# EAGLE design PT_2015_PB_MAIN_Rev1 (EAGLE 6.5.0)
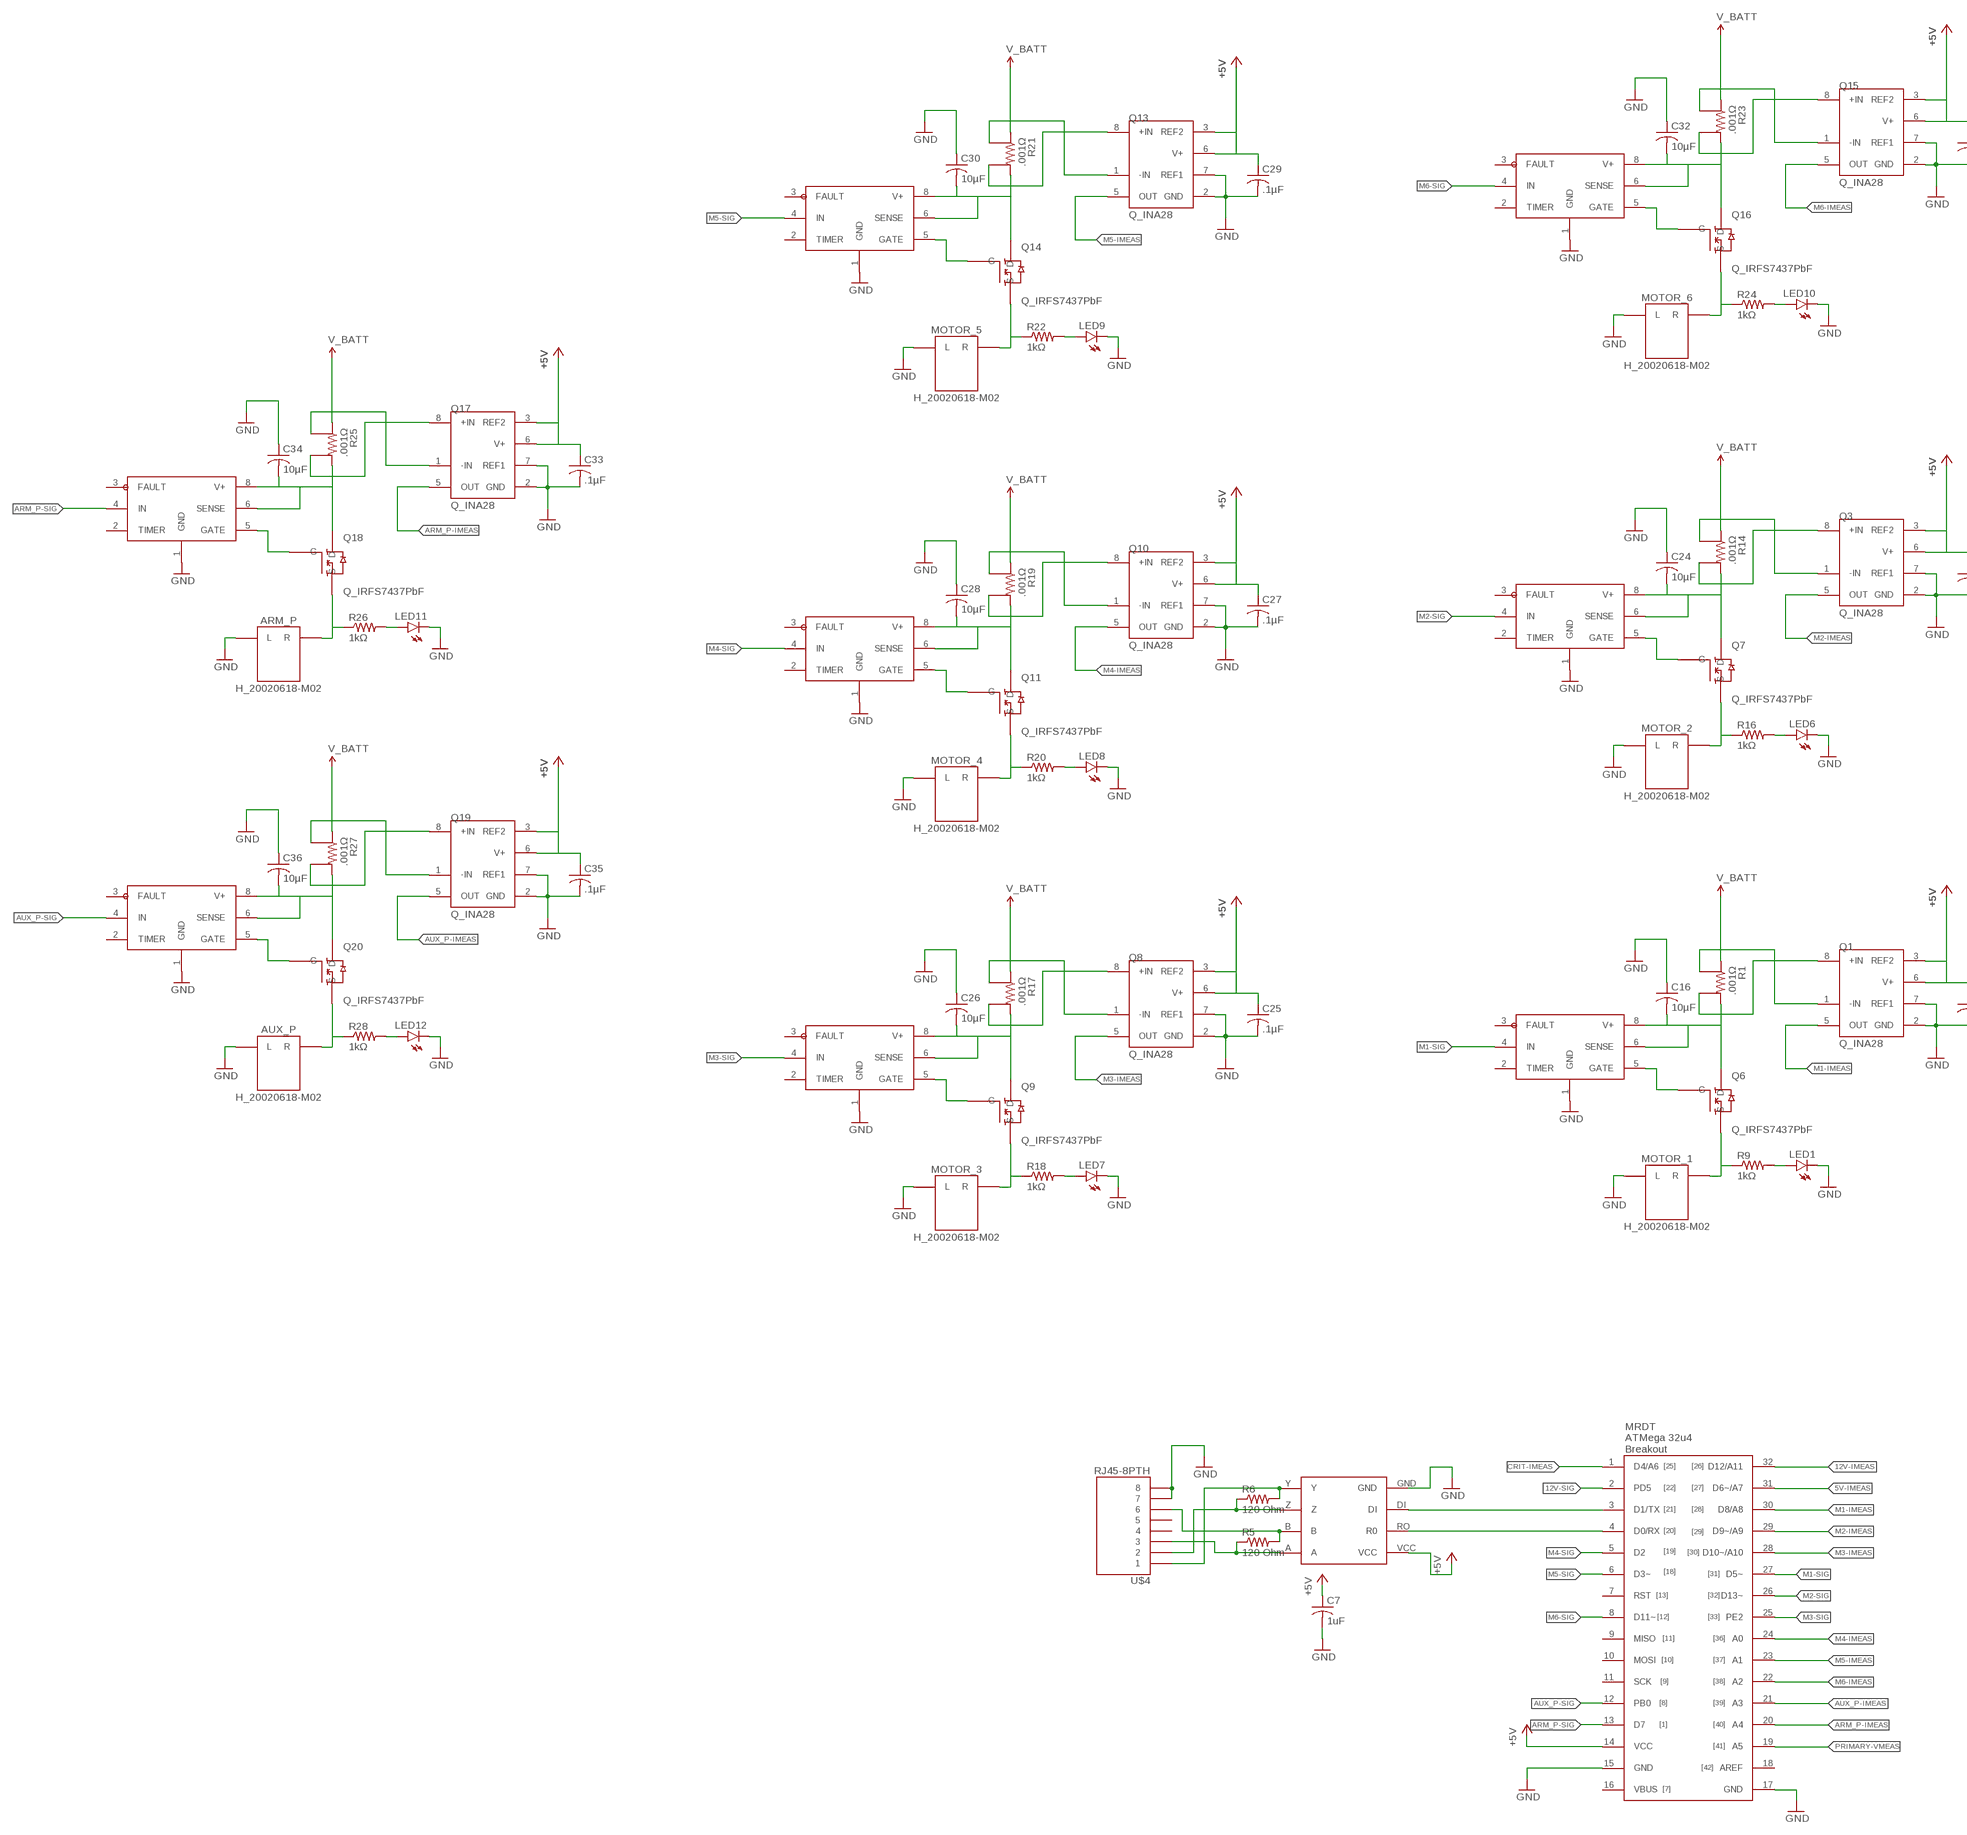
[diagram p0: schematic, sheet 1, part 1 of 2]
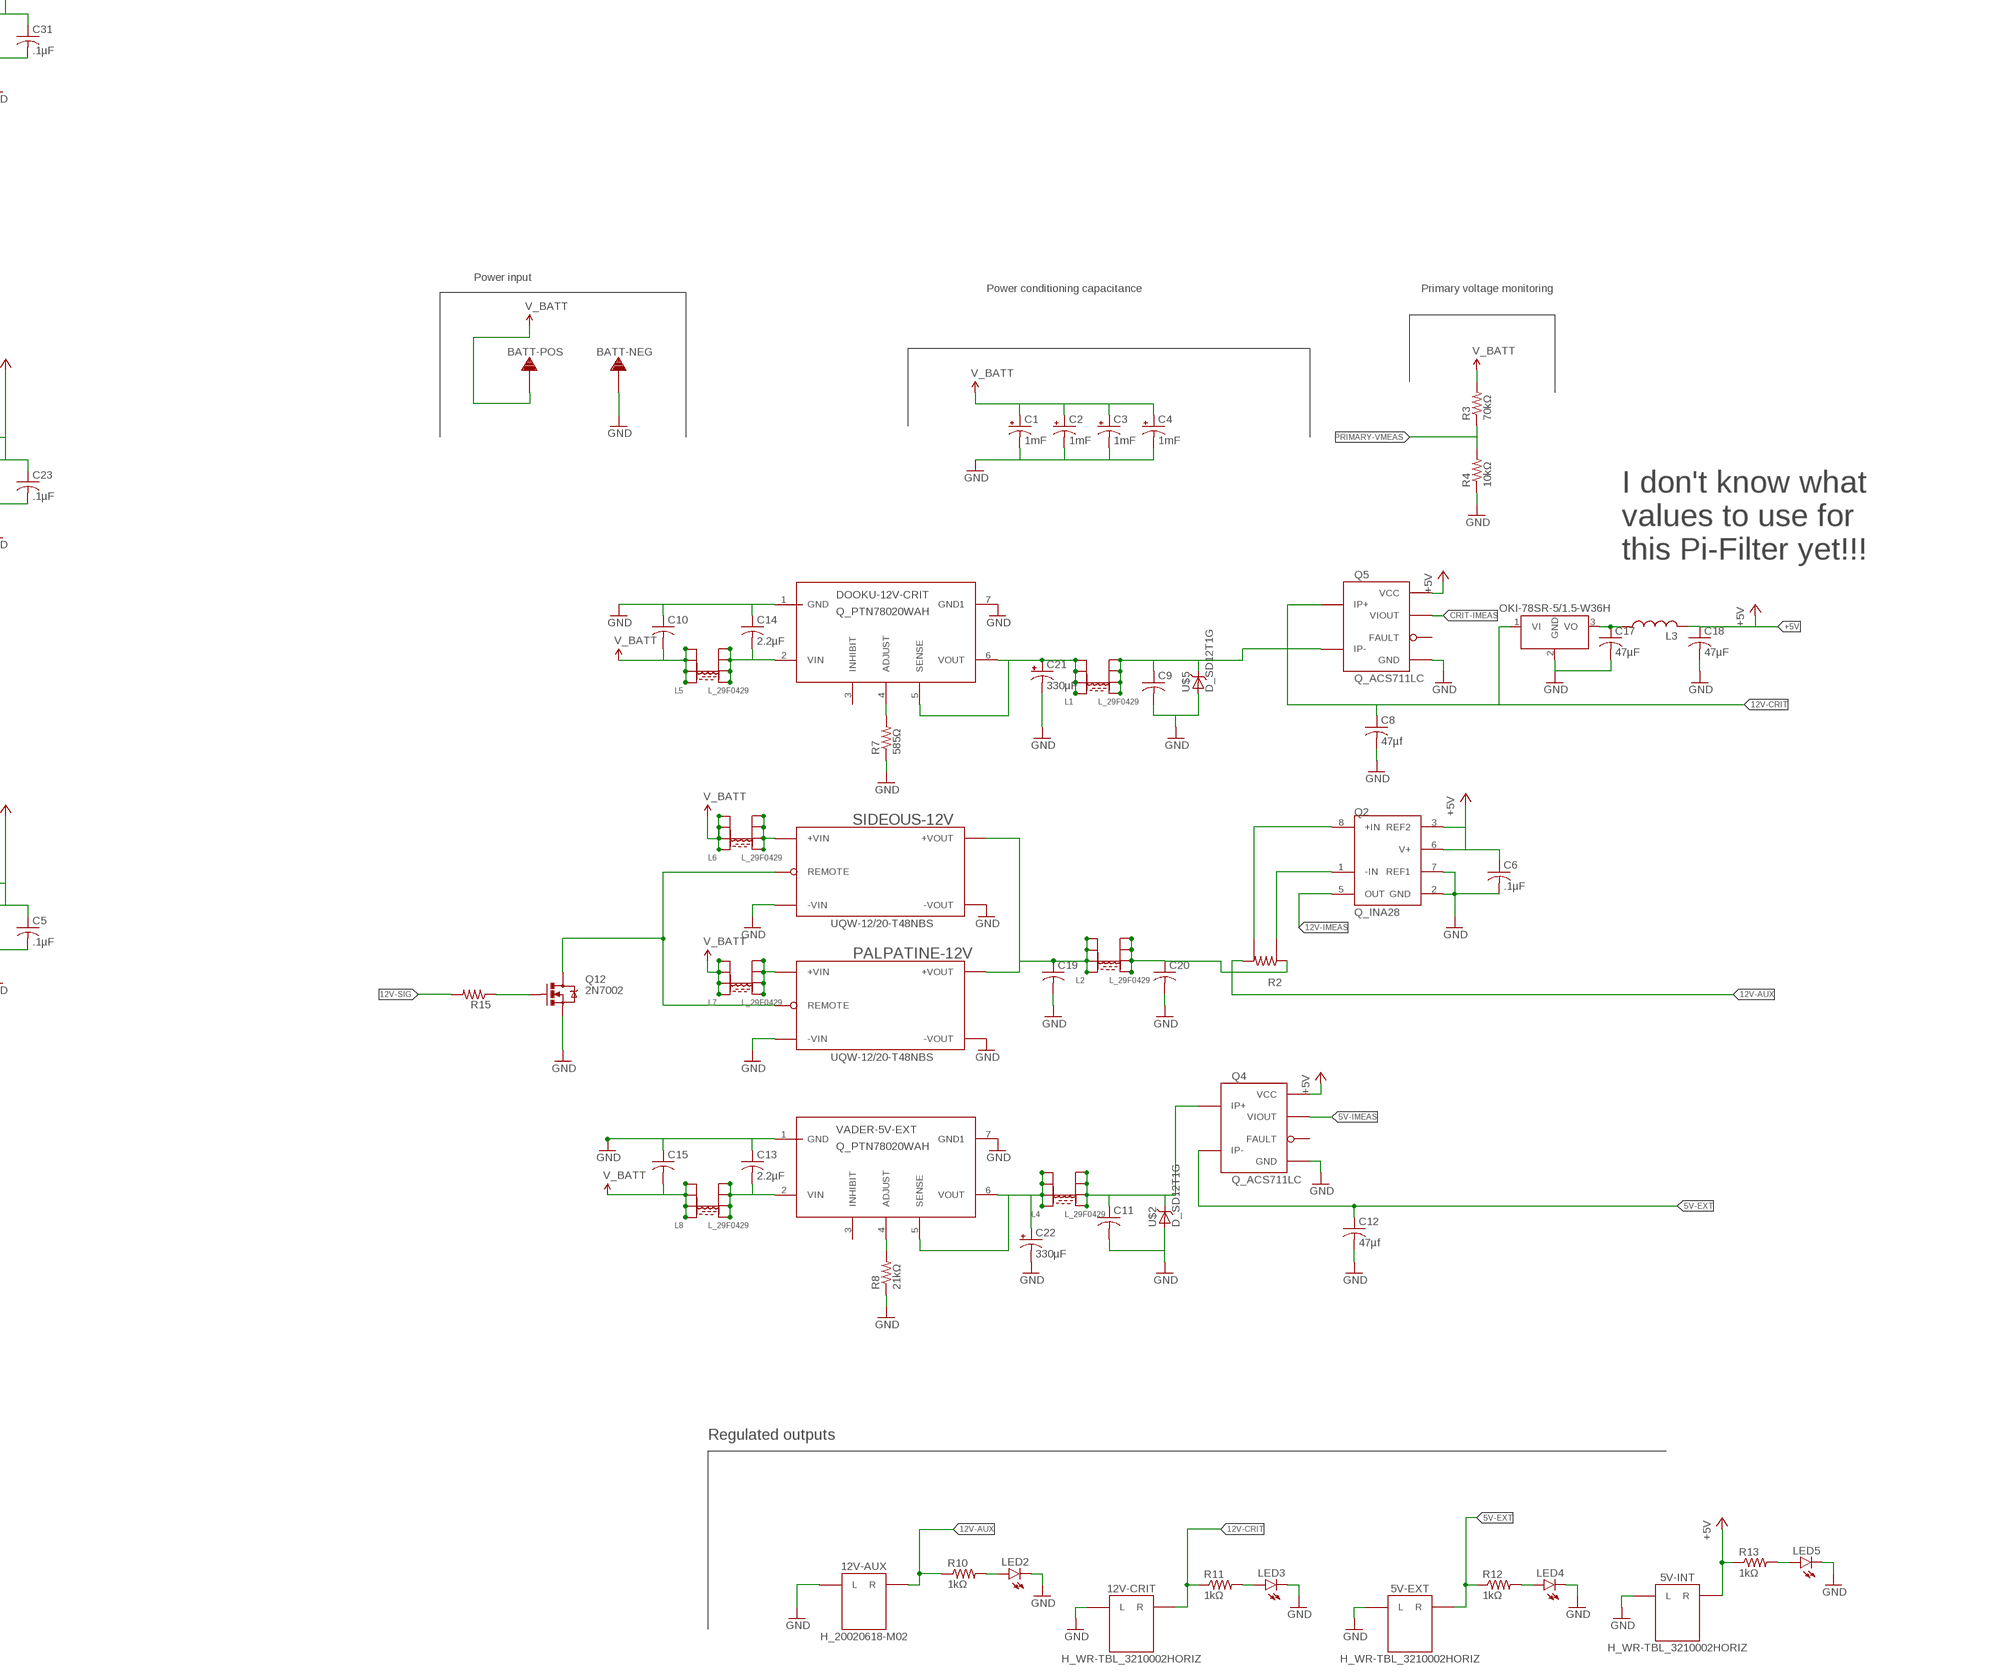
[diagram p1: schematic, sheet 1, part 2 of 2]

## Parts
5V-EXT  H_WR-TBL_3210002HORIZ  [691322110002]
5V-INT  H_WR-TBL_3210002HORIZ  [691322110002]
12V-AUX  H_20020618-M02  [20020618-M02]
12V-CRIT  H_WR-TBL_3210002HORIZ  [691322110002]
ARM_P  H_20020618-M02  [20020618-M02]
AUX_P  H_20020618-M02  [20020618-M02]
BATT-NEG  TERMINAL_HOLE  [LARGE_TERMINAL_HOLE]
BATT-POS  TERMINAL_HOLE  [LARGE_TERMINAL_HOLE]
C1  1mF  C_POL12.5MM_NORMAL  [C_12.5MM]
C2  1mF  C_POL12.5MM_NORMAL  [C_12.5MM]
C3  1mF  C_POL12.5MM_NORMAL  [C_12.5MM]
C4  1mF  C_POL12.5MM_NORMAL  [C_12.5MM]
C5  .1µF  C-USC1206  [C1206]
C6  .1µF  C-USC1206  [C1206]
C7  1uF  C-USC1206  [C1206]
C8  47µf  C-USC1206  [C1206]
C9  C-USC1206  [C1206]
C10  C-USC1206  [C1206]
C11  C-USC1206  [C1206]
C12  47µf  C-USC1206  [C1206]
C13  2.2µF  C-USC1206  [C1206]
C14  2.2µF  C-USC1206  [C1206]
C15  C-USC1206  [C1206]
C16  10µF  C-USC1206  [C1206]
C17  47µF  C-USC1206  [C1206]
C18  47µF  C-USC1206  [C1206]
C19  C-USC1206  [C1206]
C20  C-USC1206  [C1206]
C21  330µF  CPOL-USE5-8.5  [E5-8,5]
C22  330µF  CPOL-USE5-8.5  [E5-8,5]
C23  .1µF  C-USC1206  [C1206]
C24  10µF  C-USC1206  [C1206]
C25  .1µF  C-USC1206  [C1206]
C26  10µF  C-USC1206  [C1206]
C27  .1µF  C-USC1206  [C1206]
C28  10µF  C-USC1206  [C1206]
C29  .1µF  C-USC1206  [C1206]
C30  10µF  C-USC1206  [C1206]
C31  .1µF  C-USC1206  [C1206]
C32  10µF  C-USC1206  [C1206]
C33  .1µF  C-USC1206  [C1206]
C34  10µF  C-USC1206  [C1206]
C35  .1µF  C-USC1206  [C1206]
C36  10µF  C-USC1206  [C1206]
DOOKU-12V-CRIT  Q_PTN78020WAH  Q_PTN78020  [R_PDSS-T7]
L1  L_29F0429  [L_29F0429]
L2  L_29F0429  [L_29F0429]
L3  L-USL3216C  [L3216C]
L4  L_29F0429  [L_29F0429]
L5  L_29F0429  [L_29F0429]
L6  L_29F0429  [L_29F0429]
L7  L_29F0429  [L_29F0429]
L8  L_29F0429  [L_29F0429]
LED1  LED1206  [LED-1206]
LED2  LED1206  [LED-1206]
LED3  LED1206  [LED-1206]
LED4  LED1206  [LED-1206]
LED5  LED1206  [LED-1206]
LED6  LED1206  [LED-1206]
LED7  LED1206  [LED-1206]
LED8  LED1206  [LED-1206]
LED9  LED1206  [LED-1206]
LED10  LED1206  [LED-1206]
LED11  LED1206  [LED-1206]
LED12  LED1206  [LED-1206]
MOTOR_1  H_20020618-M02  [20020618-M02]
MOTOR_2  H_20020618-M02  [20020618-M02]
MOTOR_3  H_20020618-M02  [20020618-M02]
MOTOR_4  H_20020618-M02  [20020618-M02]
MOTOR_5  H_20020618-M02  [20020618-M02]
MOTOR_6  H_20020618-M02  [20020618-M02]
OKI-78SR-5/1.5-W36H  Q_OKI-78SR  [OKI-78SRH]
PALPATINE-12V  UQW-12/20-T48NBS  [U-T48-QB-NO_TRIM]
Q1  Q_INA28  [SOIC8]
Q2  Q_INA28  [SOIC8]
Q3  Q_INA28  [SOIC8]
Q4  Q_ACS711LC  [SOIC8_ACS711]
Q5  Q_ACS711LC  [SOIC8_ACS711]
Q6  Q_IRFS7437PbF  Q_IRF7437SMD  [D2PACK]
Q7  Q_IRFS7437PbF  Q_IRF7437SMD  [D2PACK]
Q8  Q_INA28  [SOIC8]
Q9  Q_IRFS7437PbF  Q_IRF7437SMD  [D2PACK]
Q10  Q_INA28  [SOIC8]
Q11  Q_IRFS7437PbF  Q_IRF7437SMD  [D2PACK]
Q12  2N7002  MOSFET-NCHANNEL2N7002PW  [SOT323]
Q13  Q_INA28  [SOIC8]
Q14  Q_IRFS7437PbF  Q_IRF7437SMD  [D2PACK]
Q15  Q_INA28  [SOIC8]
Q16  Q_IRFS7437PbF  Q_IRF7437SMD  [D2PACK]
Q17  Q_INA28  [SOIC8]
Q18  Q_IRFS7437PbF  Q_IRF7437SMD  [D2PACK]
Q19  Q_INA28  [SOIC8]
Q20  Q_IRFS7437PbF  Q_IRF7437SMD  [D2PACK]
R1  .001Ω  R_FC4L110R001JER  [R_FC4L]
R2  R_FC4L110R001JER  [R_FC4L]
R3  70kΩ  R-US_R1206  [R1206]
R4  10kΩ  R-US_R1206  [R1206]
R5  120 Ohm  RESISTOR1206  [1206]
R6  120 Ohm  RESISTOR1206  [1206]
R7  585Ω  R-US_R1206  [R1206]
R8  21kΩ  R-US_R1206  [R1206]
R9  1kΩ  RESISTOR1206  [1206]
R10  1kΩ  RESISTOR1206  [1206]
R11  1kΩ  RESISTOR1206  [1206]
R12  1kΩ  RESISTOR1206  [1206]
R13  1kΩ  RESISTOR1206  [1206]
R14  .001Ω  R_FC4L110R001JER  [R_FC4L]
R15  R-US_R1206  [R1206]
R16  1kΩ  RESISTOR1206  [1206]
R17  .001Ω  R_FC4L110R001JER  [R_FC4L]
R18  1kΩ  RESISTOR1206  [1206]
R19  .001Ω  R_FC4L110R001JER  [R_FC4L]
R20  1kΩ  RESISTOR1206  [1206]
R21  .001Ω  R_FC4L110R001JER  [R_FC4L]
R22  1kΩ  RESISTOR1206  [1206]
R23  .001Ω  R_FC4L110R001JER  [R_FC4L]
R24  1kΩ  RESISTOR1206  [1206]
R25  .001Ω  R_FC4L110R001JER  [R_FC4L]
R26  1kΩ  RESISTOR1206  [1206]
R27  .001Ω  R_FC4L110R001JER  [R_FC4L]
R28  1kΩ  RESISTOR1206  [1206]
SIDEOUS-12V  UQW-12/20-T48NBS  [U-T48-QB-NO_TRIM]
U$1  32U4_BREAKOUT  [32U4_MCU_DIP]
U$2  D_SD12T1G  [SOD-323]
U$3  MAX3077  [MAX3070E]
U$4  RJ45-8PTH  [RJ45-8]
U$5  D_SD12T1G  [SOD-323]
U$6  LT1910  [SO8]
U$7  LT1910  [SO8]
U$8  LT1910  [SO8]
U$9  LT1910  [SO8]
U$10  LT1910  [SO8]
U$11  LT1910  [SO8]
U$12  LT1910  [SO8]
U$13  LT1910  [SO8]
VADER-5V-EXT  Q_PTN78020WAH  Q_PTN78020  [R_PDSS-T7]

## Nets
5V-EXT: 5V-EXT.R C12.1 Q4.4(IP-) R12.1
5V-IMEAS: Q4.7(VIOUT) U$1.31(D6~/A7)
12V-AUX: 12V-AUX.R1(R) 12V-AUX.R2(R) R2.2 R10.1
12V-CRIT: 12V-CRIT.R C8.1 OKI-78SR-5/1.5-W36H.1(VI) Q5.1(IP+) R11.1
12V-IMEAS: Q2.5(OUT) U$1.32(D12/A11)
12V-SIG: R15.2 U$1.2(PD5)
+5V: 5V-INT.R C5.1 C6.1 C7.1 C18.1 C23.1 C25.1 C27.1 C29.1 C31.1 C33.1 C35.1 L3.2 Q1.3(REF2) Q1.6(V+) Q2.3(REF2) Q2.6(V+) Q3.3(REF2) Q3.6(V+) Q4.8(VCC) Q5.8(VCC) Q8.3(REF2) Q8.6(V+) Q10.3(REF2) Q10.6(V+) Q13.3(REF2) Q13.6(V+) Q15.3(REF2) Q15.6(V+) Q17.3(REF2) Q17.6(V+) Q19.3(REF2) Q19.6(V+) R13.1 U$1.14(VCC) U$3.VCC
ARM_P-IMEAS: Q17.5(OUT) U$1.20(A4)
ARM_P-SIG: U$1.13(D7) U$12.4(IN)
AUX_P-IMEAS: Q19.5(OUT) U$1.21(A3)
AUX_P-SIG: U$1.12(PB0) U$13.4(IN)
CRIT-IMEAS: Q5.7(VIOUT) U$1.1(D4/A6)
GND: 5V-EXT.L 5V-INT.L 12V-AUX.L1(L) 12V-AUX.L2(L) 12V-CRIT.L ARM_P.L1(L) ARM_P.L2(L) AUX_P.L1(L) AUX_P.L2(L) BATT-NEG.P$1 C1.- C2.- C3.- C4.- C5.2 C6.2 C7.2 C8.2 C9.2 C10.1 C11.2 C12.2 C13.1 C14.1 C15.1 C16.1 C17.2 C18.2 C19.2 C20.2 C21.- C22.- C23.2 C24.1 C25.2 C26.1 C27.2 C28.1 C29.2 C30.1 C31.2 C32.1 C33.2 C34.1 C35.2 C36.1 DOOKU-12V-CRIT.1(GND) DOOKU-12V-CRIT.7(GND1) LED1.C LED2.C LED3.C LED4.C LED5.C LED6.C LED7.C LED8.C LED9.C LED10.C LED11.C LED12.C MOTOR_1.L1(L) MOTOR_1.L2(L) MOTOR_2.L1(L) MOTOR_2.L2(L) MOTOR_3.L1(L) MOTOR_3.L2(L) MOTOR_4.L1(L) MOTOR_4.L2(L) MOTOR_5.L1(L) MOTOR_5.L2(L) MOTOR_6.L1(L) MOTOR_6.L2(L) OKI-78SR-5/1.5-W36H.2(GND) PALPATINE-12V.3(-VIN) PALPATINE-12V.4(-VOUT) Q1.2(GND) Q1.7(REF1) Q2.2(GND) Q2.7(REF1) Q3.2(GND) Q3.7(REF1) Q4.5(GND) Q5.5(GND) Q8.2(GND) Q8.7(REF1) Q10.2(GND) Q10.7(REF1) Q12.2(S) Q13.2(GND) Q13.7(REF1) Q15.2(GND) Q15.7(REF1) Q17.2(GND) Q17.7(REF1) Q19.2(GND) Q19.7(REF1) R4.1 R7.1 R8.1 SIDEOUS-12V.3(-VIN) SIDEOUS-12V.4(-VOUT) U$1.15(GND) U$1.17(GND) U$2.2(A) U$3.GND U$4.7 U$4.8 U$5.2(A) U$6.1(GND) U$7.1(GND) U$8.1(GND) U$9.1(GND) U$10.1(GND) U$11.1(GND) U$12.1(GND) U$13.1(GND) VADER-5V-EXT.1(GND) VADER-5V-EXT.7(GND1)
M1-IMEAS: Q1.5(OUT) U$1.30(D8/A8)
M1-SIG: U$1.27(D5~) U$6.4(IN)
M2-IMEAS: Q3.5(OUT) U$1.29(D9~/A9)
M2-SIG: U$1.26(D13~) U$7.4(IN)
M3-IMEAS: Q8.5(OUT) U$1.28(D10~/A10)
M3-SIG: U$1.25(PE2) U$8.4(IN)
M4-IMEAS: Q10.5(OUT) U$1.24(A0)
M4-SIG: U$1.5(D2) U$9.4(IN)
M5-IMEAS: Q13.5(OUT) U$1.23(A1)
M5-SIG: U$1.6(D3~) U$10.4(IN)
M6-IMEAS: Q15.5(OUT) U$1.22(A2)
M6-SIG: U$1.8(D11~) U$11.4(IN)
N$1: Q1.8(+IN) R1.SENSE2
N$2: Q1.1(-IN) R1.SENSE1
N$3: C13.2 L8.5 L8.6 L8.7 L8.8 VADER-5V-EXT.2(VIN)
N$4: PALPATINE-12V.2(REMOTE) Q12.3(D) SIDEOUS-12V.2(REMOTE)
N$5: L7.5 L7.6 L7.7 L7.8 PALPATINE-12V.1(+VIN)
N$6: L6.5 L6.6 L6.7 L6.8 SIDEOUS-12V.1(+VIN)
N$7: C19.1 L2.1 L2.2 L2.3 L2.4 PALPATINE-12V.8(+VOUT) SIDEOUS-12V.8(+VOUT)
N$8: C14.2 DOOKU-12V-CRIT.2(VIN) L5.5 L5.6 L5.7 L5.8
N$9: DOOKU-12V-CRIT.4(ADJUST) R7.2
N$10: C9.1 L1.5 L1.6 L1.7 L1.8 Q5.4(IP-) U$5.1(C)
N$11: C20.1 L2.5 L2.6 L2.7 L2.8 R2.1
N$12: Q2.8(+IN) R2.SENSE2
N$13: Q2.1(-IN) R2.SENSE1
N$14: R6.2 U$3.Y U$4.1
N$15: C22.+ L4.1 L4.2 L4.3 L4.4 VADER-5V-EXT.5(SENSE) VADER-5V-EXT.6(VOUT)
N$16: C11.1 L4.5 L4.6 L4.7 L4.8 Q4.1(IP+) U$2.1(C)
N$18: R6.1 U$3.Z U$4.2
N$19: R5.2 U$3.B U$4.6
N$20: R5.1 U$3.A U$4.3
N$21: U$1.3(D1/TX) U$3.DI
N$26: Q3.8(+IN) R14.SENSE2
N$27: Q3.1(-IN) R14.SENSE1
N$28: C24.2 Q7.TAB(D) R14.2 U$7.6(SENSE) U$7.8(V+)
N$29: MOTOR_2.R1(R) MOTOR_2.R2(R) Q7.2(S) R16.1
N$30: Q7.1(G) U$7.5(GATE)
N$31: LED6.A R16.2
N$32: Q8.8(+IN) R17.SENSE2
N$35: R8.2 VADER-5V-EXT.4(ADJUST)
N$36: C21.+ DOOKU-12V-CRIT.5(SENSE) DOOKU-12V-CRIT.6(VOUT) L1.1 L1.2 L1.3 L1.4
N$39: LED1.A R9.2
N$40: C16.2 Q6.TAB(D) R1.2 U$6.6(SENSE) U$6.8(V+)
N$41: MOTOR_1.R1(R) MOTOR_1.R2(R) Q6.2(S) R9.1
N$42: Q6.1(G) U$6.5(GATE)
N$43: Q8.1(-IN) R17.SENSE1
N$44: C26.2 Q9.TAB(D) R17.2 U$8.6(SENSE) U$8.8(V+)
N$45: MOTOR_3.R1(R) MOTOR_3.R2(R) Q9.2(S) R18.1
N$46: LED2.A R10.2
N$47: Q9.1(G) U$8.5(GATE)
N$48: LED3.A R11.2
N$49: LED7.A R18.2
N$50: LED4.A R12.2
N$51: Q10.8(+IN) R19.SENSE2
N$52: LED5.A R13.2
N$53: Q10.1(-IN) R19.SENSE1
N$54: C28.2 Q11.TAB(D) R19.2 U$9.6(SENSE) U$9.8(V+)
N$55: MOTOR_4.R1(R) MOTOR_4.R2(R) Q11.2(S) R20.1
N$56: Q11.1(G) U$9.5(GATE)
N$57: LED8.A R20.2
N$58: Q13.8(+IN) R21.SENSE2
N$59: Q13.1(-IN) R21.SENSE1
N$60: C30.2 Q14.TAB(D) R21.2 U$10.6(SENSE) U$10.8(V+)
N$61: MOTOR_5.R1(R) MOTOR_5.R2(R) Q14.2(S) R22.1
N$62: Q14.1(G) U$10.5(GATE)
N$63: LED9.A R22.2
N$64: Q15.8(+IN) R23.SENSE2
N$65: Q15.1(-IN) R23.SENSE1
N$66: C32.2 Q16.TAB(D) R23.2 U$11.6(SENSE) U$11.8(V+)
N$67: MOTOR_6.R1(R) MOTOR_6.R2(R) Q16.2(S) R24.1
N$68: Q16.1(G) U$11.5(GATE)
N$69: LED10.A R24.2
N$70: Q17.8(+IN) R25.SENSE2
N$71: Q17.1(-IN) R25.SENSE1
N$72: C34.2 Q18.TAB(D) R25.2 U$12.6(SENSE) U$12.8(V+)
N$73: ARM_P.R1(R) ARM_P.R2(R) Q18.2(S) R26.1
N$74: Q18.1(G) U$12.5(GATE)
N$75: LED11.A R26.2
N$76: Q19.8(+IN) R27.SENSE2
N$77: Q19.1(-IN) R27.SENSE1
N$78: C36.2 Q20.TAB(D) R27.2 U$13.6(SENSE) U$13.8(V+)
N$79: AUX_P.R1(R) AUX_P.R2(R) Q20.2(S) R28.1
N$80: Q20.1(G) U$13.5(GATE)
N$81: LED12.A R28.2
N$100: C17.1 L3.1 OKI-78SR-5/1.5-W36H.3(VO)
N$114: Q12.1(G) R15.1
PRIMARY-VMEAS: R3.1 R4.2 U$1.19(A5)
RXD: U$1.4(D0/RX) U$3.RO(R0)
V_BATT: BATT-POS.P$1 C1.+ C2.+ C3.+ C4.+ C10.2 C15.2 L5.1 L5.2 L5.3 L5.4 L6.1 L6.2 L6.3 L6.4 L7.1 L7.2 L7.3 L7.4 L8.1 L8.2 L8.3 L8.4 R1.1 R3.2 R14.1 R17.1 R19.1 R21.1 R23.1 R25.1 R27.1
Unconnected: DOOKU-12V-CRIT.3(INHIBIT) Q4.6(FAULT) Q5.6(FAULT) U$1.7(RST) U$1.9(MISO) U$1.10(MOSI) U$1.11(SCK) U$1.16(VBUS) U$1.18(AREF) U$4.4 U$4.5 U$6.2(TIMER) U$6.3(FAULT) U$7.2(TIMER) U$7.3(FAULT) U$8.2(TIMER) U$8.3(FAULT) U$9.2(TIMER) U$9.3(FAULT) U$10.2(TIMER) U$10.3(FAULT) U$11.2(TIMER) U$11.3(FAULT) U$12.2(TIMER) U$12.3(FAULT) U$13.2(TIMER) U$13.3(FAULT) VADER-5V-EXT.3(INHIBIT)

## Notes on the sheet
- Power input
- Power conditioning capacitance | Primary voltage monitoring
- I don't know what
  values to use for
  this Pi-Filter yet!!!
- Regulated outputs

## Library data of the parts
5V-EXT 5V-INT 12V-CRIT = MRDT-2015-PowerBoard:H_WR-TBL_32*1*0002: Wurth Electronic's 2-pin 10A pluggable screw terminal headers. Vertical and Horizantal Part Numbers: 691322110002 (Horizantal) 691321100002 (Vertical); DIGIKEY_PN: 732-2769-ND
12V-AUX ARM_P AUX_P MOTOR_1-MOTOR_6 = MRDT-2015-PowerBoard:H_20020618-M02*: 20020618-M02* header pin from FCI. Rated up to 32A
BATT-NEG BATT-POS = MRDT-2015-PowerBoard:TERMINAL_HOLE
C1-C4 = MRDT-2014-All:C_POL: Alum Elect. Cap with 10mm diameter, 5mm lead spacing and 0.7mm lead diameter
C5-C20 C23-C36 = resistor:C-US: CAPACITOR, American symbol
C21 C22 = resistor:CPOL-US: POLARIZED CAPACITOR, American symbol
DOOKU-12V-CRIT VADER-5V-EXT = MRDT-2015-PowerBoard:Q_PTN78020: TI DC/DC converter 36Vin - Adjustable output
L1 L2 L4-L8 = MRDT-2014-All:L_29F0429: Through-Hole Ferrite Bead 285 Ohm @ 100MHz
L3 = resistor:L-US: INDUCTOR, American symbol
LED1-LED12 = SparkFun-LED:LED: LEDs Standard schematic elements and footprints for 5mm, 3mm, 1206, and 0603 sized LEDs. 5mm - Spark Fun Electronics SKU : COM-00529 (and others)
OKI-78SR-5/1.5-W36H = MRDT-2015-PowerBoard:Q_OKI-78SR: 4.95W DC/DC Converter Manufacturer: Murata Part Number: OKI-78SR-5/1.5-W36H-C OKI-78SR-3.3/1.5-W36H-C
PALPATINE-12V SIDEOUS-12V = MRDT-2015-PowerBoard:UQW-12/20-T48NBS
Q1-Q3 Q8 Q10 Q13 Q15 Q17 Q19 = MRDT-2014-All:Q_INA28: 10Khz Bidirectional Current Sense Amplifier
Q4 Q5 = MRDT-2015-PowerBoard:Q_ACS711*LC: ±12.5A or ±25A Hall-effect current transducer. SOIC-8 Package with fused pads.
Q6 Q7 Q9 Q11 Q14 Q16 Q18 Q20 = MRDT-2015-PowerBoard:Q_IRF*7437: 40V 195A N-CH MOSFET switch with heatsink
Q12 = SparkFun-DiscreteSemi:MOSFET-NCHANNEL: Common NMOSFET Parts MFG P/N Store ID Prod ID FDD8780 TRANS-09984 SI7820DN TRANS-11055 FDS6630A IC-08089 2N7002PW TRANS-11151 FQP30N06L COM-10213 TRANS-10060 BSS123LT1G TRANS-08345 BSS138 TRANS-00830 BS170 2N7000; PROD_ID: TRANS-11151
R1 R2 R14 R17 R19 R21 R23 R25 R27 = MRDT-2014-All:R_FC4L110R001JER
R3 R4 R7 R8 R15 = resistor:R-US_: RESISTOR, American symbol
R5 R6 R9-R13 R16 R18 R20 R22 R24 R26 R28 = SparkFun-Passives:RESISTOR: Resistor Basic schematic elements and footprints for 0603, 1206, and PTH resistors.
U$1 = MRDT-2015-General:32U4_BREAKOUT
U$2 U$5 = MRDT-2014-All:D_SD12T1G: 12V or 5V Zener
U$3 = MAX3077:MAX3077
U$4 = SparkFun-Connectors:RJ45-8: RJ45 Jack Simple RJ45, 8-pin connection - connector for common Cat5, Cat5e, and Cat6 Ethernet cables. Footprint not yet proven in production. Connector sku is PRT-00643; Breakout PCB sku is BOB-00716.
U$6-U$13 = Jake:LT1910

## Board
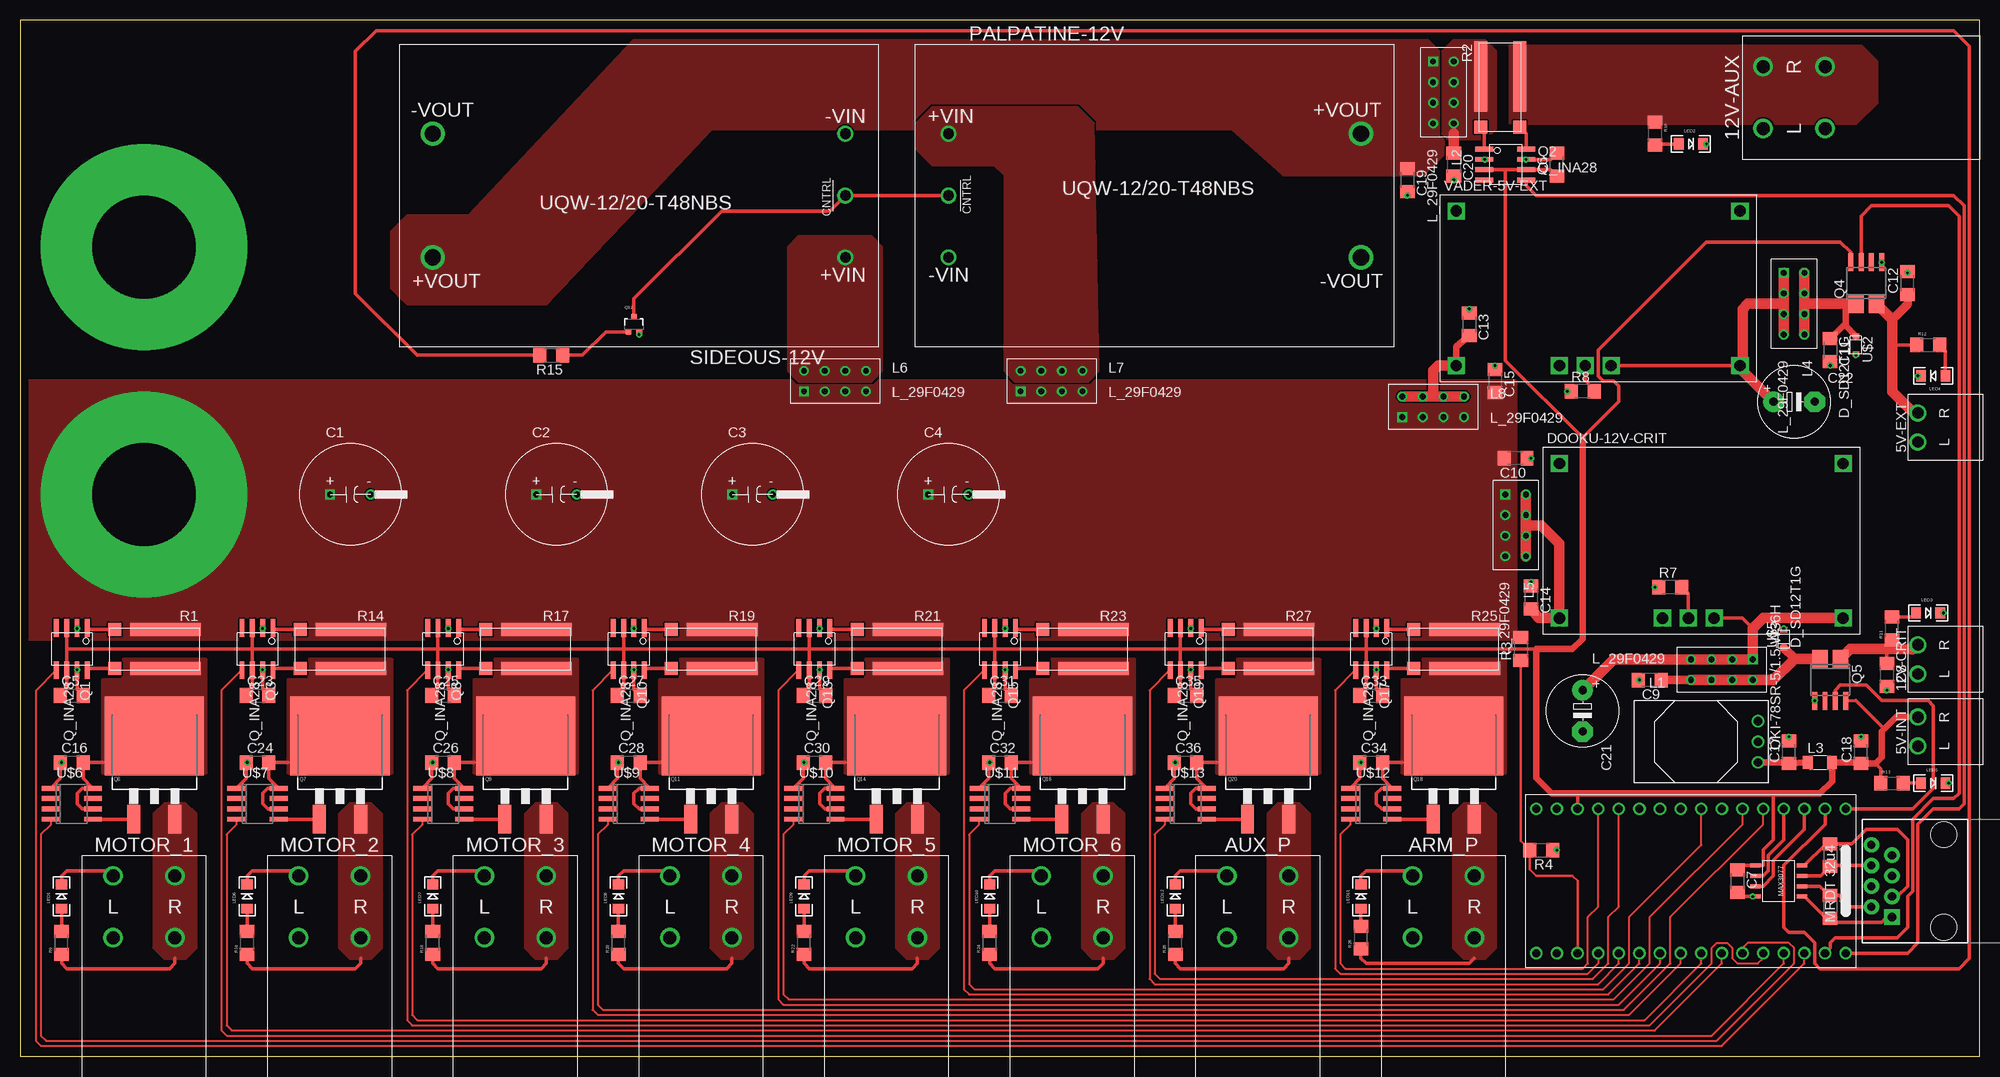
[diagram p2: board, top side]
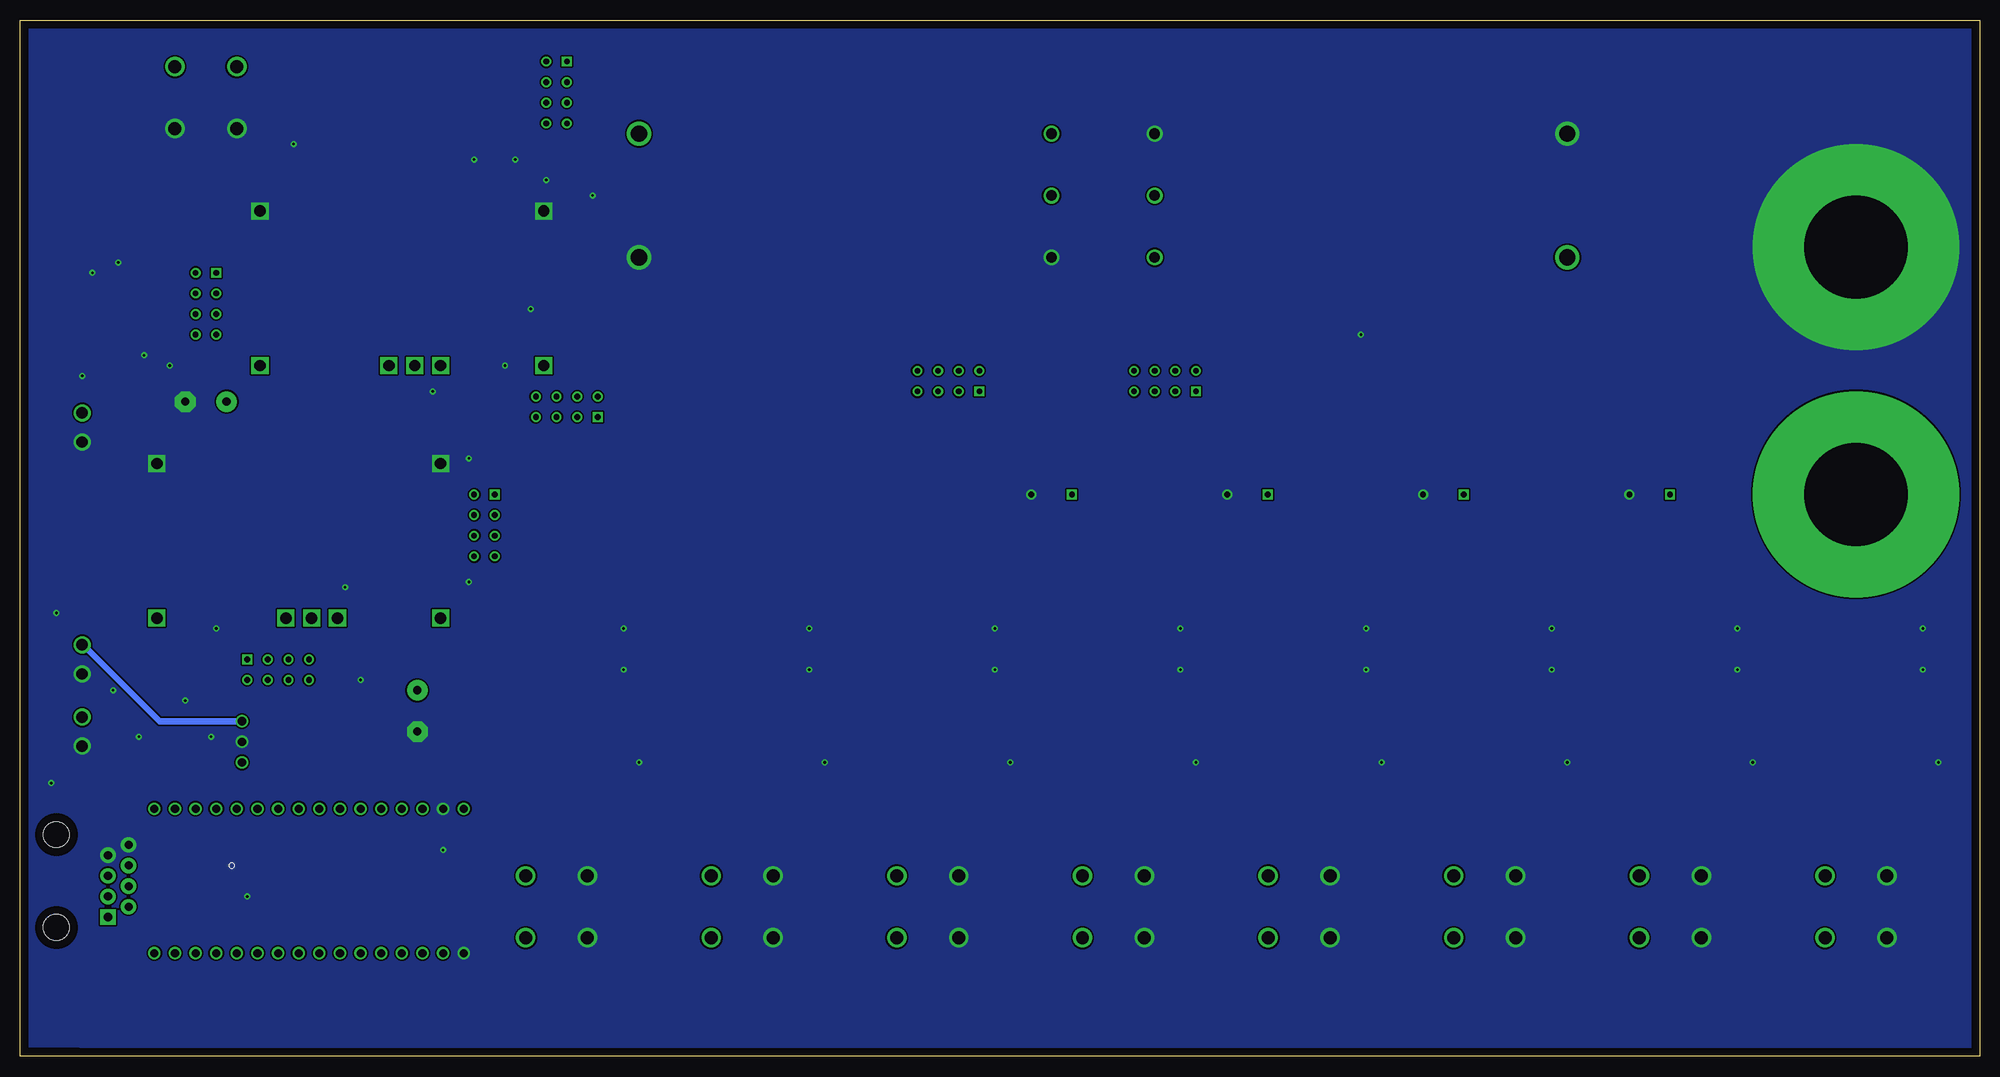
[diagram p3: board, bottom side, seen from below]

Size 241.3 x 127.64 mm. Coordinates in mm from the lower left corner, seen from the top.
Outline: 0,0 241.3,0 241.3,127.64 0,127.64 0,0
Copper layers (1*16): Top 0.035mm / dielectric 1.5mm / Bottom 0.035mm
Design rules "default *": minimum track width 10mil, minimum drill 13mil, track to track 8mil, track to pad 8mil, pad to pad 8mil, via to via 8mil, smd to smd 8mil, copper to edge 40mil, drill to drill 8mil, minimum pad ring 10mil, minimum via ring 8mil, stop-mask expansion 4mil, vias tented up to drill 0mil, thermal gap 10mil

### Footprints (pad centres in the part's own frame; a part is rotated, then mirrored left to right if it is on the bottom)
691322110002 = drill 1.4: L -1.79,0; R 1.79,0
20020618-M02 = drill 1.6: L1 -3.81,3.81; L2 -3.81,-3.81; R1 3.81,3.81; R2 3.81,-3.81
LARGE_TERMINAL_HOLE = drill 12.7 pad 25.4: P$1 0,0
C_12.5MM = drill 0.7 square: + -2.5,0 | drill 0.7: - 2.5,0
C1206 = smd 1.6 x 1.8: 1 -1.4,0; 2 1.4,0
E5-8,5 = drill 1.016 pad 2.54: + -2.54,0 | drill 1.016 pad 2.54 octagon: - 2.54,0
R_PDSS-T7 = drill 1.4 square: 1 -17.47,9.53; 2 -17.47,-9.52; 3 -4.77,-9.52; 4 -1.59,-9.52; 5 1.59,-9.52; 6 17.47,-9.52; 7 17.47,9.53
L_29F0429 = drill 0.7 square: 1 -3.81,-1.27 | drill 0.7: 2 -1.27,-1.27; 3 1.27,-1.27; 4 3.81,-1.27; 5 3.81,1.27; 6 1.27,1.27; 7 -1.27,1.27; 8 -3.81,1.27
L3216C = smd 1.2 x 1.6: 1 -1.5,0; 2 1.5,0
LED-1206 = smd 1.2 x 1.4: A -1.5,0; C 1.5,0
OKI-78SRH = drill 1.016: 1 2.54,0; 2 0,0; 3 -2.54,0
U-T48-QB-NO_TRIM = drill 1.3: 1 -25.4,7.62; 2 -25.4,0; 3 -25.4,-7.62 | drill 2: 4 25.4,-7.62; 8 25.4,7.62
SOIC8 = smd 2.2 x 0.6: 1 -2.6,1.905; 2 -2.6,0.635; 3 -2.6,-0.635; 4 -2.6,-1.905; 5 2.6,-1.905; 6 2.6,-0.635; 7 2.6,0.635; 8 2.6,1.905
SOIC8_ACS711 = smd 1.92 x 2.2: 1 -1.27,-2.6; 4 1.27,-2.6 | smd 0.6 x 2.2: 5 1.905,2.6; 6 0.635,2.6; 7 -0.635,2.6; 8 -1.905,2.6
D2PACK = smd 1.6 x 3.5: 1 -2.54,-8.275; 2 2.54,-8.275 | smd 12.2 x 9.75: TAB 0,2
SOT323 = smd 0.7 x 0.7: 1 -0.65,-0.925; 2 0.65,-0.925; 3 0,0.925
R_FC4L = smd 1.6 x 8.7: 1 2.4,-1.35; 2 -2.4,-1.35 | smd 1.6 x 1.6: SENSE1 2.4,4.9; SENSE2 -2.4,4.9
R1206 = smd 1.6 x 1.803: 1 -1.422,0; 2 1.422,0
1206 = smd 1.6 x 1.8: 1 -1.4,0; 2 1.4,0
32U4_MCU_DIP = drill 1: 1 -8.89,19.05; 2 -8.89,16.51; 3 -8.89,13.97; 4 -8.89,11.43; 5 -8.89,8.89; 6 -8.89,6.35; 7 -8.89,3.81; 8 -8.89,1.27; 9 -8.89,-1.27; 10 -8.89,-3.81; 11 -8.89,-6.35; 12 -8.89,-8.89; 13 -8.89,-11.43; 14 -8.89,-13.97; 15 -8.89,-16.51; 16 -8.89,-19.05; 17 8.89,-19.05; 18 8.89,-16.51; 19 8.89,-13.97; 20 8.89,-11.43; 21 8.89,-8.89; 22 8.89,-6.35; 23 8.89,-3.81; 24 8.89,-1.27; 25 8.89,1.27; 26 8.89,3.81; 27 8.89,6.35; 28 8.89,8.89; 29 8.89,11.43; 30 8.89,13.97; 31 8.89,16.51; 32 8.89,19.05
SOD-323 = smd 0.63 x 0.83: 1 -1.115,0; 2 1.115,0
MAX3070E = smd 0.49 x 1.3: A -1.905,2.857; B -0.635,2.857; DI 0.635,-2.857; GND 1.905,-2.857; RO -0.635,-2.857; VCC -1.905,-2.857; Y 1.905,2.857; Z 0.635,2.857
RJ45-8 = drill 1 pad 1.88 square: 1 -4.445,6.35 | drill 1 pad 1.88: 2 -3.175,8.89; 3 -1.905,6.35; 4 -0.635,8.89; 5 0.635,6.35; 6 1.905,8.89; 7 3.175,6.35; 8 4.445,8.89 | hole 3.2: -5.715,0; 5.715,0
SO8 = smd 0.6 x 2.2: 1 -1.905,-2.6; 2 -0.635,-2.6; 3 0.635,-2.6; 4 1.905,-2.6; 5 1.905,2.6; 6 0.635,2.6; 7 -0.635,2.6; 8 -1.905,2.6

### Placement (x,y rotation side)
5V-EXT  H_WR-TBL_321*0002HORIZ  [691322110002]  233.68,77.47 90 top
5V-INT  H_WR-TBL_321*0002HORIZ  [691322110002]  233.68,40.01 90 top
12V-AUX  218.44,118.11 90 top
12V-CRIT  H_WR-TBL_321*0002HORIZ  [691322110002]  233.68,48.9 90 top
ARM_P  175.26,18.41 0 top
AUX_P  152.4,18.41 0 top
BATT-NEG  15.24,99.69 0 top
BATT-POS  15.24,69.22 0 top
C1  40.64,69.22 0 top
C2  66.04,69.22 0 top
C3  90.17,69.22 0 top
C4  114.3,69.22 0 top
C5  6.35,44.45 0 top
C6  189.23,109.86 90 top
C7  211.46,21.59 270 top
C8  229.87,46.99 270 top
C9  200.66,46.35 180 top
C10  184.15,73.66 180 top
C11  222.88,87 270 top
C12  232.41,95.25 90 top
C13  178.44,90.17 270 top
C14  186.06,56.52 270 top
C15  181.61,83.19 270 top
C16  6.35,36.2 0 top
C17  217.81,37.47 90 top
C18  226.69,37.47 90 top
C19  170.81,107.95 270 top
C20  176.53,109.86 270 top
C21  192.41,42.55 270 top
C22  218.44,80.64 0 top
C23  29.21,44.45 0 top
C24  29.21,36.2 0 top
C25  52.07,44.45 0 top
C26  52.07,36.2 0 top
C27  74.93,44.45 0 top
C28  74.93,36.2 0 top
C29  97.79,44.45 0 top
C30  97.79,36.2 0 top
C31  120.65,44.45 0 top
C32  120.65,36.2 0 top
C33  166.37,44.45 0 top
C34  166.37,36.2 0 top
C35  143.51,44.45 0 top
C36  143.51,36.2 0 top
DOOKU-12V-CRIT  207.01,63.5 0 top
L1  209.55,47.62 180 top
L2  175.26,118.75 270 top
L3  221.62,36.2 0 top
L4  218.44,92.71 270 top
L5  184.15,65.41 270 top
L6  100.33,83.19 0 top
L7  127,83.19 0 top
L8  173.99,80.01 0 top
LED1  5.08,19.68 90 top
LED2  205.74,112.39 0 top
LED3  234.95,54.61 0 top
LED4  235.59,83.82 180 top
LED5  235.59,33.66 0 top
LED6  27.94,19.68 90 top
LED7  50.8,19.68 90 top
LED8  73.66,19.68 90 top
LED9  96.52,19.68 90 top
LED10  119.38,19.68 90 top
LED11  165.1,19.68 90 top
LED12  142.24,19.68 90 top
MOTOR_1  15.24,18.41 0 top
MOTOR_2  38.1,18.41 0 top
MOTOR_3  60.96,18.41 0 top
MOTOR_4  83.82,18.41 0 top
MOTOR_5  106.68,18.41 0 top
MOTOR_6  129.54,18.41 0 top
OKI-78SR-5/1.5-W36H  214,38.73 90 top
PALPATINE-12V  139.7,106.05 0 top
Q1  6.35,50.16 270 top
Q2  182.88,109.86 0 top
Q3  29.21,50.16 270 top
Q4  227.33,95.25 0 top
Q5  222.88,46.35 180 top
Q6  16.51,37.47 0 top
Q7  39.37,37.47 0 top
Q8  52.07,50.16 270 top
Q9  62.23,37.47 0 top
Q10  74.93,50.16 270 top
Q11  85.09,37.47 0 top
Q12  75.56,90.17 0 top
Q13  97.79,50.16 270 top
Q14  107.95,37.47 0 top
Q15  120.65,50.16 270 top
Q16  130.81,37.47 0 top
Q17  166.37,50.16 270 top
Q18  176.53,37.47 0 top
Q19  143.51,50.16 270 top
Q20  153.67,37.47 0 top
R1  16.51,50.16 90 top
R2  182.25,119.38 180 top
R3  184.78,50.16 90 top
R4  187.32,25.4 180 top
R5  222.88,24.77 270 top
R6  222.88,18.41 270 top
R7  203.2,57.78 0 top
R8  192.41,81.92 0 top
R9  5.08,13.97 90 top
R10  201.29,113.67 270 top
R11  230.5,52.7 90 top
R12  234.95,87.63 0 top
R13  230.5,33.66 0 top
R14  39.37,50.16 90 top
R15  65.41,86.36 180 top
R16  27.94,13.97 90 top
R17  62.23,50.16 90 top
R18  50.8,13.97 90 top
R19  85.09,50.16 90 top
R20  73.66,13.97 90 top
R21  107.95,50.16 90 top
R22  96.52,13.97 90 top
R23  130.81,50.16 90 top
R24  119.38,13.97 90 top
R25  176.53,50.16 90 top
R26  165.1,14.61 90 top
R27  153.67,50.16 90 top
R28  142.24,13.97 90 top
SIDEOUS-12V  76.2,106.05 180 top
U$1  205.74,21.59 270 top
U$2  226.06,87.63 270 top
U$3  216.53,21.59 270 top
U$4  236.85,21.59 90 top
U$5  217.17,51.44 90 top
U$6  6.35,31.11 270 top
U$7  29.21,31.11 270 top
U$8  52.07,31.11 270 top
U$9  74.93,31.11 270 top
U$10  97.79,31.11 270 top
U$11  120.65,31.11 270 top
U$12  166.37,31.11 270 top
U$13  143.51,31.11 270 top
VADER-5V-EXT  194.31,94.61 0 top

### Tracks (layer width: path | path; a pad name or v marks a point on that pad's centre or on a via)
5V-EXT
  Top 0.406: R12.1 230.5,87.63
  Top 1.016: 230.5,90.75 232.41,92.65 C12.1
  Top 1.27: Q4.4 230.5,90.75 230.5,87.63 230.5,81.92 233.16,79.26 5V-EXT.R
5V-IMEAS
  Top 0.406: Q4.7 226.69,103.5 227.97,104.78 237.49,104.78 238.76,103.5 238.76,32.38 238.12,31.75 235.59,31.75 233.04,29.21 233.04,20.32 232.41,19.68 232.41,15.88 231.14,14.61 223.52,14.61 222.88,13.97 222.88,13.34 U$1.31
12V-AUX
  pour Top (no thermals): 226.69,124.46 183.51,124.46 183.51,114.94 226.06,114.94 228.6,117.47 228.6,122.56
12V-CRIT
  Top 0.406: R11.1 230.5,50.16 231.14,50.15 232.99,50.11 | C8.1 229.87,50.16
  Top 1.27: 229.87,50.16 230.5,50.16 231.66,50.16 232.99,50.11 12V-CRIT.R | Q5.1 225.35,50.15 231.14,50.15
  Bottom 0.813: OKI-78SR-5/1.5-W36H.1 224.16,41.27 233.56,50.69 12V-CRIT.R
12V-IMEAS
  Top 0.406: Q2.5 185.48,107.25 186.69,106.05 238.12,106.05 239.4,104.78 239.4,31.11 238.76,30.48 235.59,30.48 233.68,28.57 233.68,13.97 232.41,12.7 U$1.32
12V-SIG
  Top 0.406: R15.2 48.9,86.36 41.27,93.98 41.27,123.83 43.81,126.36 238.12,126.36 240.03,124.46 240.03,12.06 238.76,10.79 221.62,10.79 220.98,11.43 220.98,13.97 219.71,15.24 217.81,15.24 217.17,15.88 217.17,23.5 222.25,28.57 U$1.2
+5V
  Top 0.406: Q1.3 5.71,50.16 | 5.71,50.16 28.57,50.16 | 28.57,50.16 51.44,50.16 | 51.44,50.16 74.3,50.16 | 74.3,50.16 97.16,50.16 | 97.16,50.16 120.02,50.16 | 120.02,50.16 142.88,50.16 | 142.88,50.16 165.74,50.16 | 165.74,50.16 186.69,50.16 | Q19.3 142.88,50.16 | Q17.3 165.74,50.16 | Q15.3 120.02,50.16 | Q13.3 97.16,50.16 | Q10.3 74.3,50.16 | Q8.3 51.44,50.16 | Q3.3 28.57,50.16 | 5.71,50.16 Q1.6 5.71,45.22 C5.1 | 28.57,50.16 Q3.6 28.57,45.22 C23.1 | 51.44,50.16 Q8.6 51.44,45.22 C25.1 | 74.3,50.16 Q10.6 74.3,45.22 C27.1 | 97.16,50.16 Q13.6 97.16,45.22 C29.1 | 120.02,50.16 Q15.6 120.02,45.22 C31.1 | 142.88,50.16 Q19.6 142.88,45.22 C35.1 | 165.74,50.16 Q17.6 165.74,45.22 C33.1 | 215.9,32.38 215.9,26.67 214.63,25.4 214.63,23.5 U$3.VCC 211.96,23.5 C7.1 | 191.77,32.38 U$1.14 | 229.55,40.32 226.06,43.81 Q5.8 | 228.47,36.06 229.1,35.43 R13.1 | 182.88,109.22 Q2.3 | 182.88,109.22 182.88,85.72 192.41,76.2 196.85,80.64 196.85,82.55 196.22,83.19 194.94,83.19 194.31,83.82 194.31,87 207.65,100.33 224.16,100.33 225.43,99.06 Q4.8 | C6.1 188.47,109.22 Q2.6 182.88,109.22
  Top 0.813: 5V-INT.R 231.03,41.8 229.55,40.32 229.24,40.01 229.24,36.83 228.47,36.06 C18.1 226.56,36.2 223.52,36.2 223.12,36.42 L3.2 223.12,33.88 221.62,32.38 215.9,32.38 191.77,32.38 188.59,32.38 186.69,34.29 186.69,50.16 191.13,50.16 192.41,51.44 192.41,76.2
ARM_P-IMEAS
  Top 0.254: Q17.5 164.41,47.56 161.93,45.09 161.93,10.79 162.56,10.16 193.04,10.16 194.31,11.43 U$1.20
ARM_P-SIG
  Top 0.254: U$12.4 163.77,28.52 162.56,27.3 162.56,11.43 163.19,10.79 192.41,10.79 193.04,11.43 193.04,17.14 194.31,18.41 U$1.13
AUX_P-IMEAS
  Top 0.254: Q19.5 141.54,47.56 139.06,45.09 139.06,9.53 139.7,8.89 194.31,8.89 196.85,11.43 U$1.21
AUX_P-SIG
  Top 0.254: U$13.4 140.91,28.52 139.7,27.3 139.7,10.16 140.34,9.53 193.68,9.53 195.58,11.43 195.58,17.14 196.85,18.41 U$1.12
CRIT-IMEAS
  Top 0.406: Q5.7 223.52,45.09 224.16,45.72 227.33,45.72 229.24,43.81 234.95,43.81 235.59,43.18 235.59,33.02 233.04,30.48 U$1.1
GND  (via drill 0.33)
  Top 0.305: 188.59,25.4 R4.1 v189.23,25.4
  Top 0.406: v144.15,47.62 Q19.7 144.15,45.22 C35.2 | Q19.2 v144.15,52.7 | v167,52.7 Q17.2 | v167,47.62 Q17.7 167,45.22 C33.2 | Q15.2 v121.28,52.7 | v121.28,47.62 Q15.7 121.28,45.22 C31.2 | v98.42,47.62 Q13.7 98.42,45.22 C29.2 | Q13.2 v98.42,52.7 | Q10.2 v75.56,52.7 | v75.56,47.62 Q10.7 75.56,45.22 C27.2 | v52.7,52.7 Q8.2 | v52.7,47.62 Q8.7 52.7,45.22 C25.2 | Q3.2 v29.84,52.7 | v29.84,47.62 Q3.7 29.84,45.22 C23.2 | Q1.2 v6.99,52.7 | v6.99,47.62 Q1.7 6.99,45.22 C5.2 | LED11.C 165.1,22.23 165.74,22.86 170.81,22.86 ARM_P.L1 | LED12.C 142.24,22.23 142.88,22.86 147.96,22.86 AUX_P.L1 | LED10.C 119.38,22.23 120.02,22.86 125.09,22.86 MOTOR_6.L1 | LED9.C 96.52,22.23 97.16,22.86 102.23,22.86 MOTOR_5.L1 | LED8.C 73.66,22.23 74.3,22.86 79.38,22.86 MOTOR_4.L1 | LED7.C 50.8,22.23 51.44,22.86 56.52,22.86 MOTOR_3.L1 | LED6.C 27.94,22.23 28.57,22.86 33.66,22.86 MOTOR_2.L1 | LED1.C 5.08,22.23 5.71,22.86 10.79,22.86 MOTOR_1.L1 | U$6.1 4.95,34.22 C16.1 v5.08,36.2 | U$7.1 27.81,34.22 C24.1 v27.94,36.2 | U$8.1 50.67,34.22 C26.1 v50.8,36.2 | U$9.1 73.53,34.22 C28.1 v73.66,36.2 | U$10.1 96.39,34.22 C30.1 v96.52,36.2 | U$11.1 119.25,34.22 C32.1 v119.38,36.2 | U$13.1 142.11,34.22 C36.1 v142.24,36.2 | U$12.1 164.97,34.22 C34.1 v165.1,36.2 | U$3.GND v213.36,19.68 211.96,19.68 C7.2 | v201.29,57.78 R7.1 | C9.2 v199.39,46.35 | v217.17,52.7 U$5.2 | Q5.5 v220.98,43.81 | C8.2 v229.87,45.09 | C14.1 v186.06,58.42 | C17.2 v217.81,39.37 | v226.69,39.37 C18.2 | LED5.C v237.49,33.66 | LED3.C v236.85,54.61 | v180.34,110.49 Q2.2 | v185.42,110.49 Q2.7 188.47,110.49 C6.2 | v176.53,107.95 C20.2 | 170.81,106.68 C19.2 v170.81,106.05 | v186.06,73.66 C10.1 | C11.2 v222.88,85.09 | U$2.2 v226.06,86.36
  Top 0.406: LED4.C v233.68,83.82 | C12.2 v232.41,96.52 | LED2.C v207.65,112.39 | C15.1 v181.61,85.09 | v229.24,97.79 Q4.5 | Q12.2 76.22,88.92 v76.2,88.9
  Top 0.813: C13.1 v178.44,92.08 | v190.5,81.92 R8.1
  pour Bottom (no thermals): 245.75,144.78 0,143.51 0,0 245.75,1.27
M1-IMEAS
  Top 0.254: Q1.5 1.91,45.02 1.91,1.91 2.54,1.27 209.55,1.27 219.71,11.43 U$1.30
M1-SIG
  Top 0.254: U$6.4 3.75,28.52 2.54,27.3 2.54,2.54 3.17,1.91 208.91,1.91 218.44,11.43 218.44,13.34 217.81,13.97 212.72,13.97 212.09,13.34 U$1.27
M2-IMEAS
  Top 0.254: Q3.5 27.25,47.56 24.77,45.09 24.77,3.17 25.4,2.54 208.28,2.54 217.17,11.43 U$1.29
M2-SIG
  Top 0.254: U$7.4 26.61,28.52 25.4,27.3 25.4,3.81 26.04,3.17 201.29,3.17 209.55,11.43 U$1.26
M3-IMEAS
  Top 0.254: Q8.5 50.1,47.56 47.62,45.09 47.62,4.45 48.26,3.81 200.66,3.81 208.28,11.43 208.28,13.34 208.91,13.97 210.19,13.97 210.82,13.34 210.82,12.06 211.46,11.43 214,11.43 214.63,12.06 U$1.28
M3-SIG
  Top 0.254: U$8.4 49.47,28.52 48.26,27.3 48.26,5.08 48.9,4.45 200.03,4.45 207.01,11.43 U$1.25
M4-IMEAS
  Top 0.254: Q10.5 72.97,47.56 70.48,45.09 70.48,5.71 71.12,5.08 198.12,5.08 204.47,11.43 U$1.24
M4-SIG
  Top 0.254: U$9.4 72.33,28.52 71.12,27.3 71.12,6.35 71.75,5.71 197.49,5.71 203.2,11.43 203.2,17.14 214.63,28.57 U$1.5
M5-IMEAS
  Top 0.254: Q13.5 95.83,47.56 93.34,45.09 93.34,6.99 93.98,6.35 196.85,6.35 201.93,11.43 U$1.23
M5-SIG
  Top 0.254: U$10.4 95.19,28.52 93.98,27.3 93.98,7.62 94.61,6.99 196.22,6.99 200.66,11.43 200.66,17.14 212.09,28.57 U$1.6
M6-IMEAS
  Top 0.254: Q15.5 118.69,47.56 116.2,45.09 116.2,8.26 116.84,7.62 195.58,7.62 199.39,11.43 U$1.22
M6-SIG
  Top 0.254: U$11.4 118.05,28.52 116.84,27.3 116.84,8.89 117.47,8.26 194.94,8.26 198.12,11.43 198.12,17.14 207.01,26.04 U$1.8
N$1
  Top 0.406: R1.SENSE2 8.46,47.77 Q1.8
N$2
  Top 0.406: R1.SENSE1 8.46,52.56 Q1.1
N$3
  Top 0.813: VADER-5V-EXT.2 176.84,87.44 C13.2
  Top 1.27: 173.99,81.28 L8.7 L8.8 | 173.99,81.28 L8.6 L8.5 | VADER-5V-EXT.2 174.63,85.09 173.99,84.45 173.99,81.28
N$4
  Top 0.406: PALPATINE-12V.2 SIDEOUS-12V.2 99.69,104.14 86.36,104.14 75.56,93.34 Q12.3
N$5
  pour Top (no thermals): 121.28,108.58 121.28,84.45 122.56,83.19 131.44,83.19 132.72,84.45 132.08,114.94 130.18,116.84 112.39,116.84 110.49,114.94 110.49,111.76 112.39,109.86 120.02,109.86
N$6
  pour Top (no thermals): 94.61,99.69 94.61,84.45 95.89,83.19 104.78,83.19 106.05,84.45 106.05,99.69 104.78,100.97 95.89,100.97
N$7
  pour Top (rank 3, no thermals): 45.72,101.6 45.72,94.61 47.62,92.71 64.77,92.71 85.09,114.3 149.22,114.3 154.94,109.22 155.57,108.58 172.72,108.58 175.26,111.12 175.26,123.19 173.35,125.09 75.56,125.09 55.24,103.5 47.62,103.5
N$8
  Top 1.27: L5.8 L5.7 185.42,65.41 | 185.42,65.41 L5.6 L5.5 | 185.42,65.41 187.32,65.41 189.54,63.19 DOOKU-12V-CRIT.2 187,53.98 C14.2
N$9
  Top 0.406: R7.2 205.42,56.99 DOOKU-12V-CRIT.4
N$10
  Top 1.016: U$5.1 218.44,49.05 218.44,48.9 | L1.5 C9.1
  Top 1.27: L1.5 L1.6 L1.7 L1.8 215.9,46.35 218.44,48.9 218.5,48.95 Q5.4
N$11
  Top 1.27: C20.1 176.53,113.67
  pour Top (no thermals): 176.53,125.09 175.26,123.83 175.26,113.67 175.9,113.03 180.34,113.03 181.61,114.3 181.61,123.83 180.34,125.09
N$12
  Top 0.406: R2.SENSE2 185.48,113.64 Q2.8
N$13
  Top 0.406: R2.SENSE1 180.28,114.05 Q2.1
N$14
  Top 0.406: U$4.1 229.87,17.14 229.24,16.51 223.65,16.51 R6.2 222.38,17.02 219.71,19.68 U$3.Y
N$15
  Top 0.406: VADER-5V-EXT.5 VADER-5V-EXT.6
  Top 1.27: 217.17,92.71 212.72,92.71 212.09,92.08 212.09,85.41 VADER-5V-EXT.6 211.78,84.77 C22.+ | 217.17,92.71 L4.2 L4.1 | 217.17,92.71 L4.3 L4.4
N$16
  Top 0.813: C11.1 224.72,90.23 | 224.72,90.23 224.79,90.3 224.79,92.71 | U$2.1 224.72,90.08 224.72,90.23
  Top 1.27: L4.5 L4.6 219.71,92.71 | 219.71,92.71 L4.7 | 219.71,94.61 L4.7 | L4.7 L4.8 | Q4.1 226,92.71 224.79,92.71 219.71,92.71
N$18
  Top 0.406: U$4.2 225.43,18.41 224.03,19.82 R6.1 222.38,20.32 222.25,20.32 221.62,20.95 U$3.Z
N$19
  Top 0.406: U$4.6 223.01,23.5 R5.2 221.75,22.23 U$3.B
N$20
  Top 0.406: U$4.3 231.14,19.68 232.41,20.95 232.41,26.67 231.14,27.94 227.33,27.94 225.56,26.16 R5.1 222.75,26.04 222.25,26.04 219.71,23.5 U$3.A
N$21
  Top 0.406: U$3.DI 214.63,20.95 215.9,22.23 215.9,24.13 219.71,27.94 U$1.3
N$26
  Top 0.406: Q3.8 31.32,47.77 R14.SENSE2
N$27
  Top 0.406: R14.SENSE1 31.32,52.56 Q3.1
N$28
  Top 0.406: 33.02,36.2 C24.2 30.61,34.22 U$7.8 30.48,33.02 29.84,32.38 29.84,31.11 30.48,30.48 U$7.6
  pour Top (no thermals): 33.02,46.35 33.02,34.92 45.72,34.92 45.72,48.9 35.56,48.9 35.56,46.35
N$29
  Top 0.406: R16.1 27.94,11.43 28.57,10.79 41.27,10.79 41.91,11.43 41.91,12.06
  pour Top (no thermals): 40.64,31.11 43.18,31.11 44.45,29.84 44.45,13.34 43.18,12.06 40.64,12.06 39.37,13.34 39.37,29.84
N$30
  Top 0.406: Q7.1 31.83,29.19 U$7.5
N$31
  Top 0.406: LED6.A R16.2
N$32
  Top 0.406: R17.SENSE2 54.17,47.77 Q8.8
N$35
  Top 0.406: VADER-5V-EXT.4 192.72,83.35 R8.2
N$36
  Top 0.406: 213.36,52.7 212.09,53.98 DOOKU-12V-CRIT.5
  Top 1.27: DOOKU-12V-CRIT.6 214.63,53.98 213.36,52.7 L1.1 L1.2 L1.3 L1.4 196.22,48.9 C21.+
N$39
  Top 0.406: LED1.A R9.2
N$40
  Top 0.406: 10.16,36.2 C16.2 7.75,34.22 U$6.8 7.62,33.02 6.99,32.38 6.99,31.11 7.62,30.48 U$6.6
  pour Top (no thermals): 10.16,46.35 10.16,34.92 22.86,34.92 22.86,48.9 12.7,48.9 12.7,46.35
N$41
  Top 0.406: R9.1 5.08,11.43 5.71,10.79 18.41,10.79 19.05,11.43 19.05,12.06
  pour Top (no thermals): 17.78,31.11 20.32,31.11 21.59,29.84 21.59,13.34 20.32,12.06 17.78,12.06 16.51,13.34 16.51,29.84
N$42
  Top 0.406: Q6.1 8.97,29.19 U$6.5
N$43
  Top 0.406: R17.SENSE1 54.17,52.56 Q8.1
N$44
  Top 0.406: 55.88,36.2 C26.2 53.47,34.22 U$8.8 53.34,33.02 52.7,32.38 52.7,31.11 53.34,30.48 U$8.6
  pour Top (no thermals): 55.88,46.35 55.88,34.92 68.58,34.92 68.58,48.9 58.42,48.9 58.42,46.35
N$45
  Top 0.406: R18.1 50.8,11.43 51.44,10.79 64.14,10.79 64.77,11.43 64.77,12.06
  pour Top (no thermals): 63.5,31.11 66.04,31.11 67.31,29.84 67.31,13.34 66.04,12.06 63.5,12.06 62.23,13.34 62.23,29.84
N$46
  Top 0.406: LED2.A 202.06,112.39 R10.2
N$47
  Top 0.406: Q9.1 54.69,29.19 U$8.5
N$48
  Top 0.406: R11.2 232.94,54.1 LED3.A
N$49
  Top 0.406: LED7.A R18.2
N$50
  Top 0.406: R12.2 237.09,86.89 LED4.A
N$51
  Top 0.406: R19.SENSE2 77.03,47.77 Q10.8
N$52
  Top 0.406: R13.2 LED5.A
N$53
  Top 0.406: R19.SENSE1 77.03,52.56 Q10.1
N$54
  Top 0.406: 79.38,36.2 C28.2 76.33,34.22 U$9.8 76.2,33.02 75.56,32.38 75.56,31.11 76.2,30.48 U$9.6
  pour Top (no thermals): 78.74,46.35 78.74,34.92 91.44,34.92 91.44,48.9 81.28,48.9 81.28,46.35
N$55
  Top 0.406: R20.1 73.66,11.43 74.3,10.79 87,10.79 87.63,11.43 87.63,12.06
  pour Top (no thermals): 86.36,31.11 88.9,31.11 90.17,29.84 90.17,13.34 88.9,12.06 86.36,12.06 85.09,13.34 85.09,29.84
N$56
  Top 0.406: Q11.1 77.55,29.19 U$9.5
N$57
  Top 0.406: LED8.A R20.2
N$58
  Top 0.406: R21.SENSE2 99.89,47.77 Q13.8
N$59
  Top 0.406: R21.SENSE1 99.89,52.56 Q13.1
N$60
  Top 0.406: 101.6,36.2 C30.2 99.19,34.22 U$10.8 99.06,33.02 98.42,32.38 98.42,31.11 99.06,30.48 U$10.6
  pour Top (no thermals): 101.6,46.35 101.6,34.92 114.3,34.92 114.3,48.9 104.14,48.9 104.14,46.35
N$61
  Top 0.406: R22.1 96.52,11.43 97.16,10.79 109.86,10.79 110.49,11.43 110.49,12.06
  pour Top (no thermals): 109.22,31.11 111.76,31.11 113.03,29.84 113.03,13.34 111.76,12.06 109.22,12.06 107.95,13.34 107.95,29.84
N$62
  Top 0.406: Q14.1 100.41,29.19 U$10.5
N$63
  Top 0.406: LED9.A R22.2
N$64
  Top 0.406: R23.SENSE2 122.75,47.77 Q15.8
N$65
  Top 0.406: R23.SENSE1 122.75,52.56 Q15.1
N$66
  Top 0.406: 124.46,36.2 C32.2 122.05,34.22 U$11.8 121.92,33.02 121.28,32.38 121.28,31.11 121.92,30.48 U$11.6
  pour Top (no thermals): 124.46,46.35 124.46,34.92 137.16,34.92 137.16,48.9 127,48.9 127,46.35
N$67
  Top 0.406: R24.1 119.38,11.43 120.02,10.79 132.72,10.79 133.35,11.43 133.35,12.06
  pour Top (no thermals): 132.08,31.11 134.62,31.11 135.89,29.84 135.89,13.34 134.62,12.06 132.08,12.06 130.81,13.34 130.81,29.84
N$68
  Top 0.406: Q16.1 123.27,29.19 U$11.5
N$69
  Top 0.406: LED10.A R24.2
N$70
  Top 0.406: R25.SENSE2 168.47,47.77 Q17.8
N$71
  Top 0.406: R25.SENSE1 168.47,52.56 Q17.1
N$72
  Top 0.406: 170.18,36.2 C34.2 167.77,34.22 U$12.8 167.64,33.02 167,32.38 167,31.11 167.64,30.48 U$12.6
  pour Top (no thermals): 170.18,46.35 170.18,34.92 182.88,34.92 182.88,48.9 172.72,48.9 172.72,46.35
N$73
  Top 0.406: R26.1 165.1,12.06 165.74,11.43 178.44,11.43 179.07,12.06
  pour Top (no thermals): 177.8,31.11 180.34,31.11 181.61,29.84 181.61,13.34 180.34,12.06 177.8,12.06 176.53,13.34 176.53,29.84
N$74
  Top 0.406: Q18.1 168.99,29.19 U$12.5
N$75
  Top 0.406: LED11.A R26.2
N$76
  Top 0.406: R27.SENSE2 145.62,47.77 Q19.8
N$77
  Top 0.406: R27.SENSE1 145.62,52.56 Q19.1
N$78
  Top 0.406: 147.32,36.2 C36.2 144.91,34.22 U$13.8 144.78,33.02 144.15,32.38 144.15,31.11 144.78,30.48 U$13.6
  pour Top (no thermals): 147.32,46.35 147.32,34.92 160.02,34.92 160.02,48.9 149.86,48.9 149.86,46.35
N$79
  Top 0.406: R28.1 142.24,11.43 142.88,10.79 155.57,10.79 156.21,11.43 156.21,12.06
  pour Top (no thermals): 154.94,31.11 157.48,31.11 158.75,29.84 158.75,13.34 157.48,12.06 154.94,12.06 153.67,13.34 153.67,29.84
N$80
  Top 0.406: Q20.1 146.13,29.19 U$13.5
N$81
  Top 0.406: LED12.A R28.2
N$100
  Top 0.813: OKI-78SR-5/1.5-W36H.3 217.68,36.2 C17.1 217.71,36.06 L3.1
N$114
  Top 0.406: Q12.1 72.1,89.25 69.22,86.36 R15.1
PRIMARY-VMEAS
  Top 0.305: R3.1 184.78,26.52 R4.2 185.9,23.01 186.69,22.23 191.13,22.23 191.77,21.59 U$1.19
RXD
  Top 0.406: U$3.RO 214.63,22.23 215.26,22.86 215.26,24.77 217.17,26.67 U$1.4
V_BATT
  pour Top (rank 2, no thermals): 184.15,83.19 -1.27,83.19 -1.27,51.44 184.15,51.44